# Altium schematic sheet pwm_bot_sheild.SchDoc
size A4; Date: 09 July 2012; Author: Simon Markham; DrawnBy: Simon Markham; Engineer: Simon Markham; Organization: Markham Designs
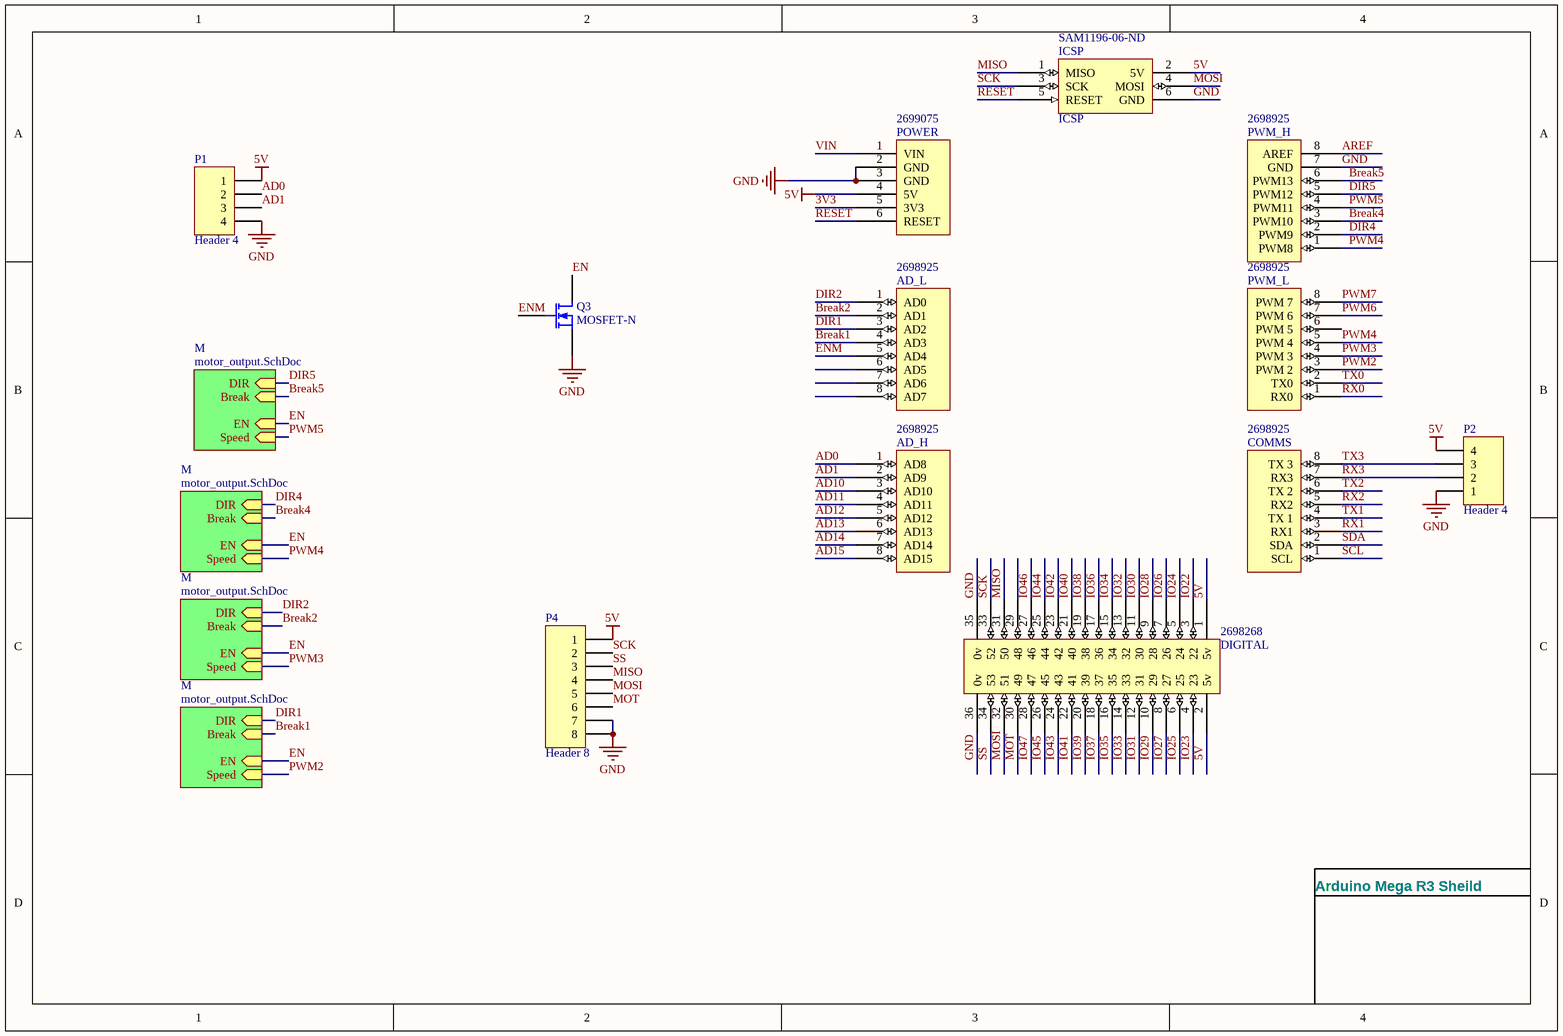
[diagram p0: pwm_bot_sheild.SchDoc]

## Parts
AD_H  Supplier Part Number 4: 2698925  [Header 8x1 8.5mm]  (hidden comment: AD_H)
AD_L  Supplier Part Number 5: 2698925  [Header 8x1 8.5mm]  (hidden comment: AD_L)
COMMS  Supplier Part Number 4: 2698925  [Header 8x1 8.5mm]  (hidden comment: Communication)
DIGITAL  Supplier Part Number 5: 2698268  [HEADER 36X 8MM]  (hidden comment: IO_36)
ICSP  ICSP  Supplier Part Number 5: SAM1196-06-ND  [ICSP]
P1  Header 4  [B4B-XH-A]
P2  Header 4  [B4B-XH-A]
P4  Header 8  [B8B-XH-A]
POWER  Supplier Part Number 2: 2699075  [Header 6x1 8.5mm]  (hidden comment: POWER)
PWM_H  Supplier Part Number 4: 2698925  [Header 8x1 8.5mm]  (hidden comment: PWM_H)
PWM_L  Supplier Part Number 4: 2698925  [Header 8x1 8.5mm]  (hidden comment: PWM_L)
Q3  MOSFET-N  [Tranny]

## Sub-sheets
M = motor_output.SchDoc: Break (in), EN (in), Speed (in), DIR (in)
M = motor_output.SchDoc: Break (in), EN (in), Speed (in), DIR (in)
M = motor_output.SchDoc: Break (in), EN (in), Speed (in), DIR (in)
M = motor_output.SchDoc: Break (in), EN (in), Speed (in), DIR (in)

## Nets
5V: DIGITAL.1(5v) DIGITAL.2(5v) ICSP.2(5V) P1.1 P2.4 P4.1 POWER.4(5V)
GND: DIGITAL.35(0v) DIGITAL.36(0v) ICSP.6(GND) P1.4 P2.1 P4.7 P4.8 POWER.2(GND) POWER.3(GND) PWM_H.7(GND) Q3.3(S)
3V3: POWER.5(3V3)
AD0: AD_H.1(AD8) P1.2
AD1: AD_H.2(AD9) P1.3
AD10: AD_H.3(AD10)
AD11: AD_H.4(AD11)
AD12: AD_H.5(AD12)
AD13: AD_H.6(AD13)
AD14: AD_H.7(AD14)
AD15: AD_H.8(AD15)
AREF: PWM_H.8(AREF)
Break1: AD_L.4(AD3) ; sheet M/Break
Break2: AD_L.2(AD1) ; sheet M/Break
Break4: PWM_H.3(PWM10) ; sheet M/Break
Break5: PWM_H.6(PWM13) ; sheet M/Break
DIR1: AD_L.3(AD2) ; sheet M/DIR
DIR2: AD_L.1(AD0) ; sheet M/DIR
DIR4: PWM_H.2(PWM9) ; sheet M/DIR
DIR5: PWM_H.5(PWM12) ; sheet M/DIR
EN: Q3.1(D) ; sheet M/EN, sheet M/EN, sheet M/EN, sheet M/EN
ENM: AD_L.5(AD4) Q3.2(G)
IO22: DIGITAL.3(22)
IO23: DIGITAL.4(23)
IO24: DIGITAL.5(24)
IO25: DIGITAL.6(25)
IO26: DIGITAL.7(26)
IO27: DIGITAL.8(27)
IO28: DIGITAL.9(28)
IO29: DIGITAL.10(29)
IO30: DIGITAL.11(30)
IO31: DIGITAL.12(31)
IO32: DIGITAL.13(32)
IO33: DIGITAL.14(33)
IO34: DIGITAL.15(34)
IO35: DIGITAL.16(35)
IO36: DIGITAL.17(36)
IO37: DIGITAL.18(37)
IO38: DIGITAL.19(38)
IO39: DIGITAL.20(39)
IO40: DIGITAL.21(40)
IO41: DIGITAL.22(41)
IO42: DIGITAL.23(42)
IO43: DIGITAL.24(43)
IO44: DIGITAL.25(44)
IO45: DIGITAL.26(45)
IO46: DIGITAL.27(46)
IO47: DIGITAL.28(47)
MISO: DIGITAL.31(50) ICSP.1(MISO) P4.4
MOSI: DIGITAL.32(51) ICSP.4(MOSI) P4.5
MOT: DIGITAL.30(49) P4.6
PWM2: PWM_L.3(PWM_2) ; sheet M/Speed
PWM3: PWM_L.4(PWM_3) ; sheet M/Speed
PWM4: PWM_H.1(PWM8) PWM_L.5(PWM_4) ; sheet M/Speed
PWM5: PWM_H.4(PWM11) ; sheet M/Speed
PWM6: PWM_L.7(PWM_6)
PWM7: PWM_L.8(PWM_7)
RESET: ICSP.5(RESET) POWER.6(RESET)
RX0: PWM_L.1(RX0)
RX1: COMMS.3(RX1)
RX2: COMMS.5(RX2)
RX3: COMMS.7(RX3) P2.2
SCK: DIGITAL.33(52) ICSP.3(SCK) P4.2
SCL: COMMS.1(SCL)
SDA: COMMS.2(SDA)
SS: DIGITAL.34(53) P4.3
TX0: PWM_L.2(TX0)
TX1: COMMS.4(TX_1)
TX2: COMMS.6(TX_2)
TX3: COMMS.8(TX_3) P2.3
VIN: POWER.1(VIN)

Not connected (* = marked no-connect by the designer): AD_L 6(AD5) 7(AD6) 8(AD7); DIGITAL 29(48); PWM_L 6(PWM_5)

## Notes on the sheet
- Arduino Mega R3 Sheild

## Library data of the parts
P1 P2 = Header 4: Header, 4-Pin; LatestRevisionDate: 17-Jul-2002; LatestRevisionNote: Re-released for DXP Platform.; Publisher: Altium Limited
P4 = Header 8: Header, 8-Pin; LatestRevisionDate: 17-Jul-2002; LatestRevisionNote: Re-released for DXP Platform.; Publisher: Altium Limited
Q3 = MOSFET-N: N-Channel MOSFET; Published: 8-Jun-2000; LatestRevisionDate: 17-Jul-2002; LatestRevisionNote: Re-released for DXP Platform.; PackageVersion: 1995/1996; PackageReference: E3; Publisher: Altium Limited; PackageDescription: TO, Flat Index; 3 In-Line, Axial Leads; Body Dia. 4.6mm; Lead Dia. 0.5 mm (max)
AD_H = AD_H: Supplier 1: Arrow; Supplier Part Number 1: 2698940; Supplier 2: Arrow; Supplier Part Number 2: 2698939; Supplier 3: Digi-Key; Supplier Part Number 3: SAM1198-08-ND; Supplier 4: Arrow
AD_L = AD_L: Supplier 1: Digi-Key; Supplier Part Number 1: SAM1198-08-ND; Supplier 2: Arrow; Supplier Part Number 2: 2698939; Supplier 3: Arrow; Supplier Part Number 3: 2698940; Supplier 4: Arrow; Supplier Part Number 4: 43085273; Supplier 5: Arrow
COMMS = Communication: Supplier 1: Digi-Key; Supplier Part Number 1: SAM1198-08-ND; Supplier 2: Arrow; Supplier Part Number 2: 2698940; Supplier 3: Arrow; Supplier Part Number 3: 2698939; Supplier 4: Arrow
DIGITAL = IO_36: Supplier 1: Digi-Key; Supplier Part Number 1: SAM1196-18-ND; Supplier 2: Arrow; Supplier Part Number 2: 48117090; Supplier 3: Arrow; Supplier Part Number 3: 46093326; Supplier 4: Arrow; Supplier Part Number 4: 2698278; Supplier 5: Arrow
ICSP = ICSP: Supplier 1: Digi-Key; Supplier Part Number 1: SAM1185-06-ND; Supplier 2: Arrow; Supplier Part Number 2: 2699117; Supplier 3: Arrow; Supplier Part Number 3: 43862781; Supplier 4: Arrow; Supplier Part Number 4: 2699091; Supplier 5: Digi-Key
POWER = POWER: Supplier 1: Arrow; Supplier Part Number 1: 52553843; Supplier 2: Arrow; Supplier 3: Digi-Key; Supplier Part Number 3: SAM1198-06-ND; Supplier 4: Arrow; Supplier Part Number 4: 2699089; Supplier 5: Arrow; Supplier Part Number 5: 2699088
PWM_H = PWM_H: Supplier 1: Digi-Key; Supplier Part Number 1: SAM1198-08-ND; Supplier 2: Arrow; Supplier Part Number 2: 2698940; Supplier 3: Arrow; Supplier Part Number 3: 2698939; Supplier 4: Arrow
PWM_L = PWM_L: Supplier 1: Arrow; Supplier Part Number 1: 2698940; Supplier 2: Arrow; Supplier Part Number 2: 2698939; Supplier 3: Digi-Key; Supplier Part Number 3: SAM1198-08-ND; Supplier 4: Arrow